# Altium schematic sheet Transceiver.SchDoc: FMC SDR Transceiver Board
size 420 x 297 mm; CheckedBy: -; CompanyName: CERN; DrawnBy: DrawnBy; Organization: CERN; Address1: European Organization for Nuclear Research; Address2: CH-1211 Genčve 23 - Switzerland; Revision: -; SheetNumber: -; SheetTotal: -; EDA_Number: EDA-XXXXX-VX-X; Projet: -; ModifiedBy: -; CreateDate: XX/XX/XXXX; CheckedDate: -; Title2: AD9364; DivGrp: TE/MPE; Designer: Designer; ModifiedDate: -
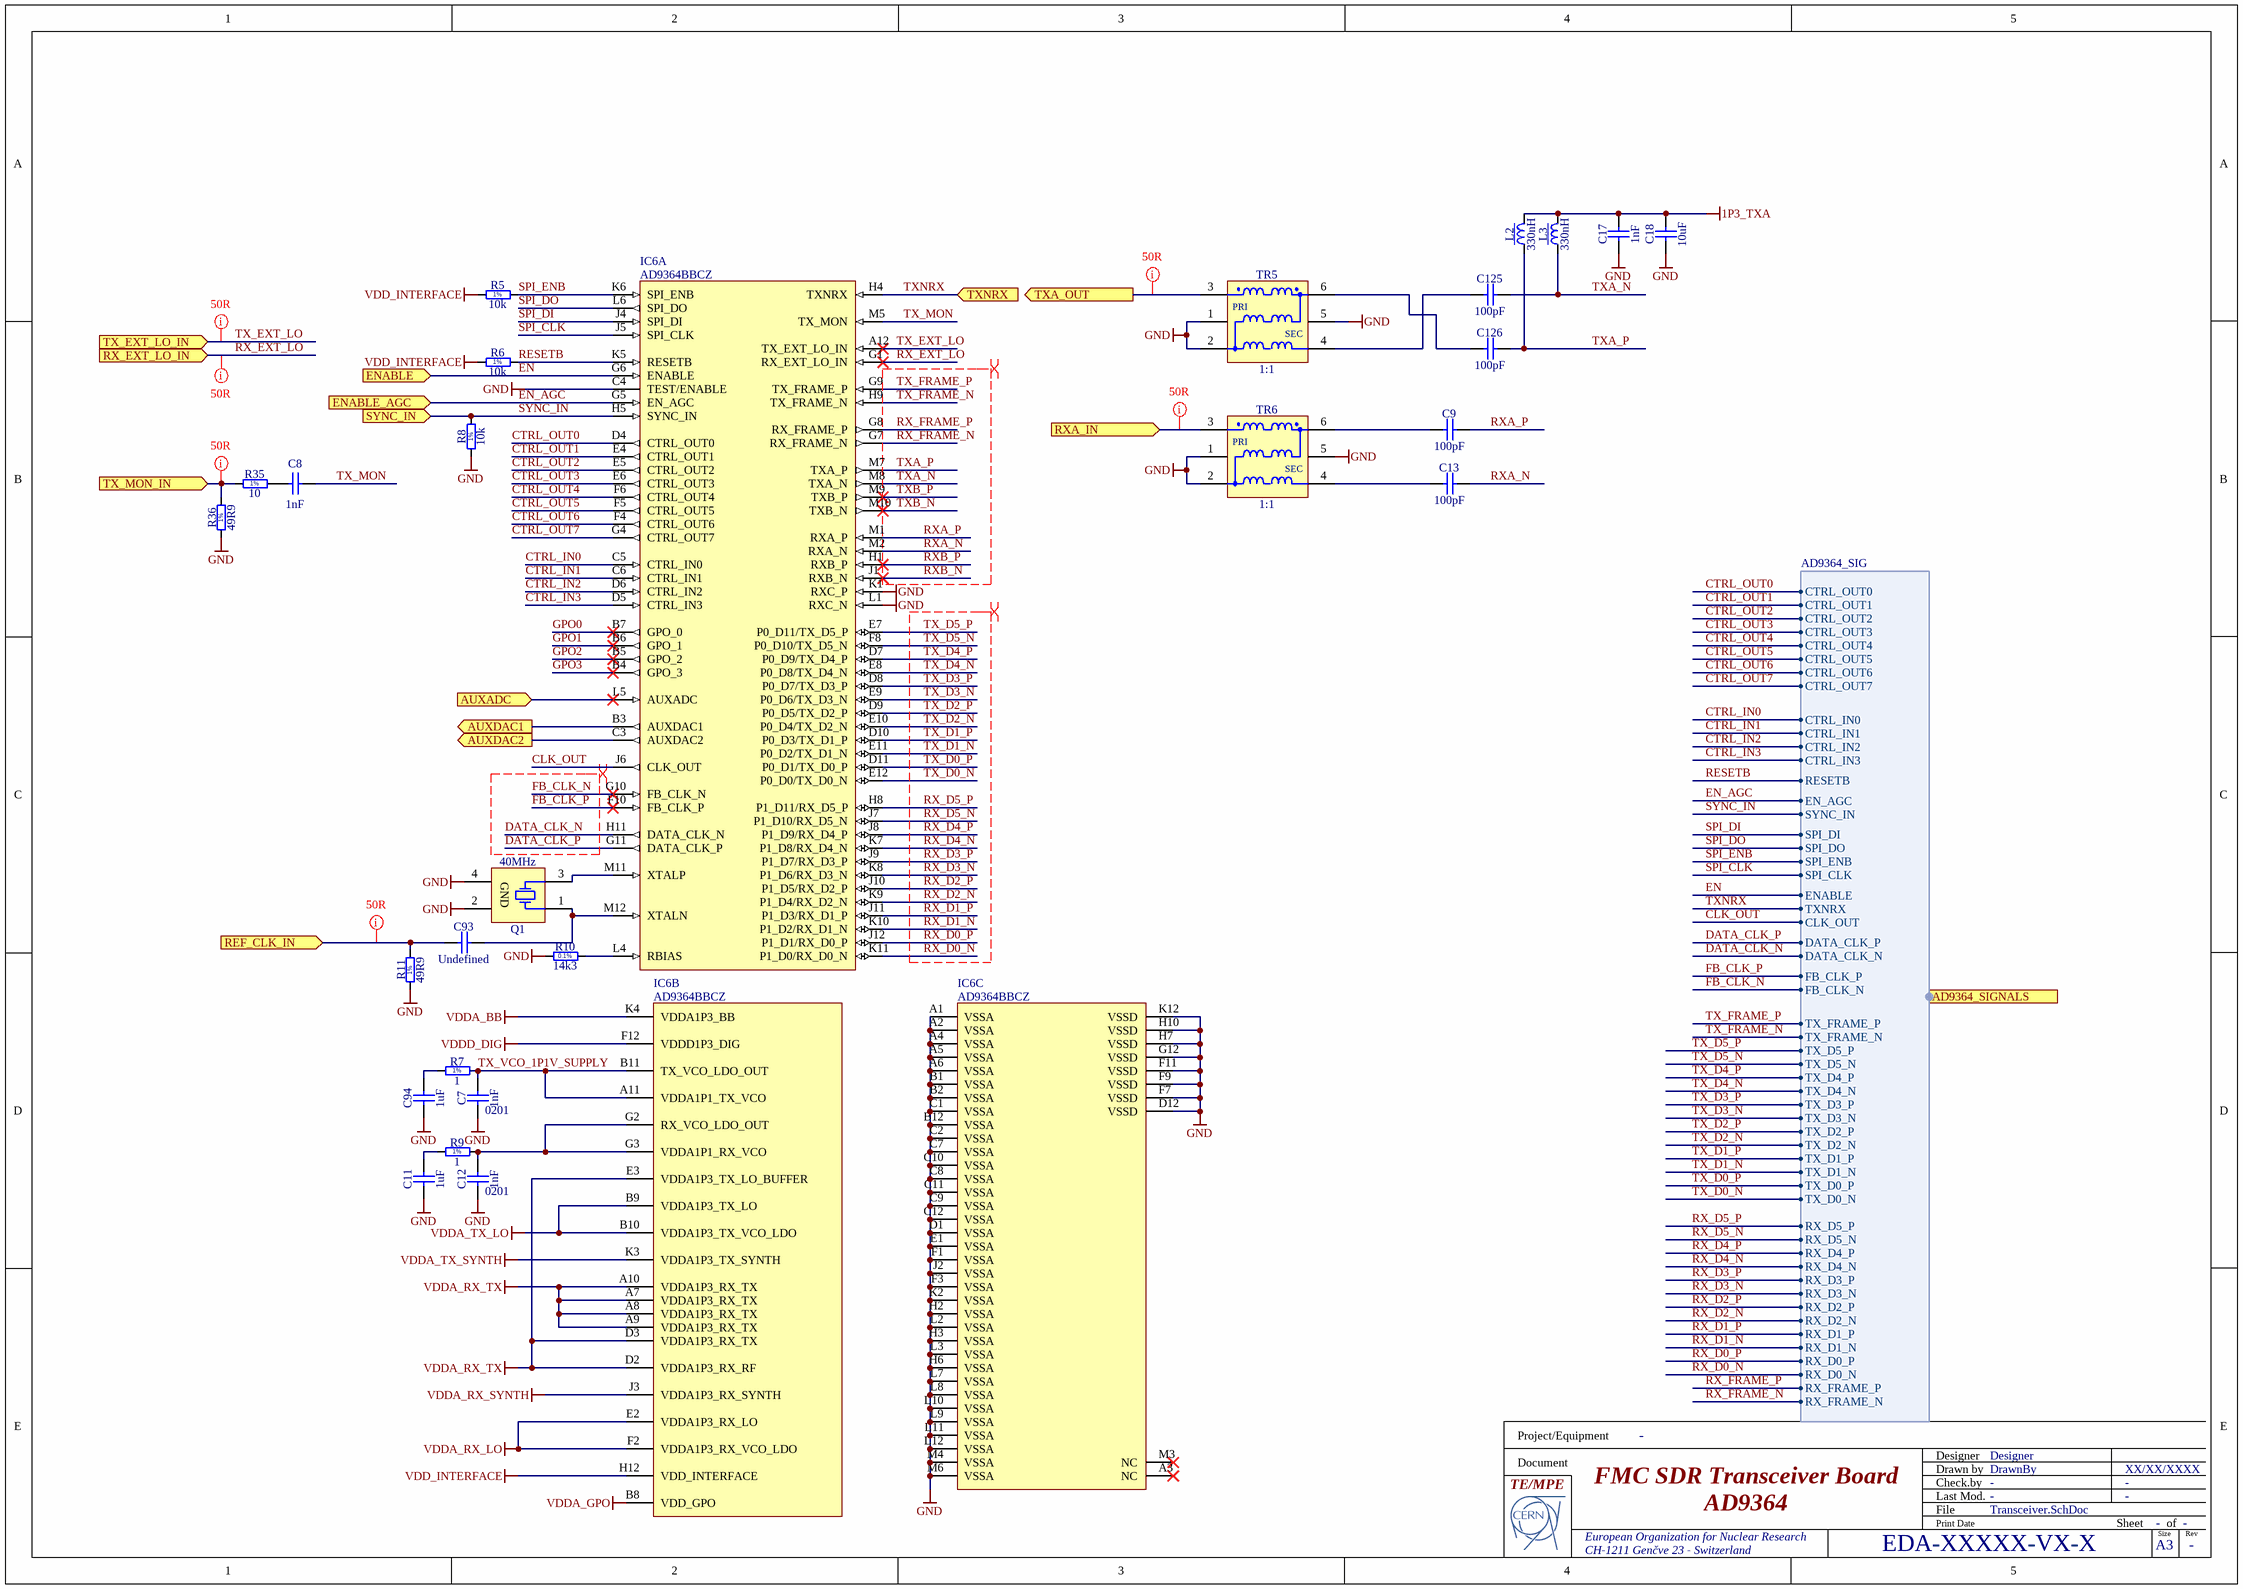
[diagram p0: Transceiver.SchDoc]

## Parts
C7  1nF  Case: 0201  [CAPC0603X33N]
C8  1nF  [CAPC1005X55N]
C9  100pF  [CAPC1005X55N]
C11  1uF  [CAPC1005X55N]
C12  1nF  Case: 0201  [CAPC0603X33N]
C13  100pF  [CAPC1005X55N]
C17  1nF  [CAPC1005X55N]
C18  10uF  [CAPC1608X80N]
C93  Undefined  [CAPC1608X90N]
C94  1uF  [CAPC1005X55N]
C125  100pF  [CAPC1005X55N]
C126  100pF  [CAPC1005X55N]
IC6  AD9364BBCZ  [BGA144C80P12X12_1000X1000X170]  (parts A,B,C of 3)
L2  330nH  [IND_COILCRAFT_0805CS]
L3  330nH  [IND_COILCRAFT_0805CS]
Q1  40MHz  [XTAL_EPSON_TSX-3225]
R5  10k  [RESC1005X40N]
R6  10k  [RESC1005X40N]
R7  1  [RESC1005X40N]
R8  10k  [RESC1005X40N]
R9  1  [RESC1005X40N]
R10  14k3  [RESC1608X55N]
R11  49R9  [RESC1005X40N]
R35  10  [RESC1005X40N]
R36  49R9  [RESC1005X40N]
TR5  1:1  [XFMR_MINI-CIRCUITS_DB1627]
TR6  1:1  [XFMR_MINI-CIRCUITS_DB1627]

## Ports
AD9364_SIGNALS (in, harness AD9364_SIG), AUXADC (in), AUXDAC1 (out), AUXDAC2 (out), ENABLE (in), ENABLE_AGC (in), REF_CLK_IN (in), RX_EXT_LO_IN (in), RXA_IN (in), SYNC_IN (in), TX_EXT_LO_IN (in), TX_MON_IN (in), TXA_OUT (out), TXNRX (in)

## Harnesses
AD9364_SIG: CTRL_OUT0, CTRL_OUT1, CTRL_OUT2, CTRL_OUT3, CTRL_OUT4, CTRL_OUT5, CTRL_OUT6, CTRL_OUT7, CTRL_IN0, CTRL_IN1, CTRL_IN2, CTRL_IN3, RESETB, EN_AGC, SYNC_IN, SPI_DI, SPI_DO, SPI_ENB, SPI_CLK, ENABLE, TXNRX, CLK_OUT, DATA_CLK_P, DATA_CLK_N, FB_CLK_P, FB_CLK_N, TX_FRAME_P, TX_FRAME_N, TX_D5_P, TX_D5_N, TX_D4_P, TX_D4_N, TX_D3_P, TX_D3_N, TX_D2_P, TX_D2_N, TX_D1_P, TX_D1_N, TX_D0_P, TX_D0_N, RX_D5_P, RX_D5_N, RX_D4_P, RX_D4_N, RX_D3_P, RX_D3_N, RX_D2_P, RX_D2_N, RX_D1_P, RX_D1_N, RX_D0_P, RX_D0_N, RX_FRAME_P, RX_FRAME_N

## Nets
1P3_TXA: C17.2 C18.2 L2.2 L3.2
GND: C7.1 C11.1 C12.1 C17.1 C18.1 C94.1 IC6.A1(VSSA) IC6.A2(VSSA) IC6.A4(VSSA) IC6.A5(VSSA) IC6.A6(VSSA) IC6.B1(VSSA) IC6.B2(VSSA) IC6.B12(VSSA) IC6.C1(VSSA) IC6.C2(VSSA) IC6.C4(TEST/ENABLE) IC6.C7(VSSA) IC6.C8(VSSA) IC6.C9(VSSA) IC6.C10(VSSA) IC6.C11(VSSA) IC6.C12(VSSA) IC6.D1(VSSA) IC6.D12(VSSD) IC6.E1(VSSA) IC6.F1(VSSA) IC6.F3(VSSA) IC6.F7(VSSD) IC6.F9(VSSD) IC6.F11(VSSD) IC6.G12(VSSD) IC6.H2(VSSA) IC6.H3(VSSA) IC6.H6(VSSA) IC6.H7(VSSD) IC6.H10(VSSD) IC6.J2(VSSA) IC6.K1(RXC_P) IC6.K2(VSSA) IC6.K12(VSSD) IC6.L1(RXC_N) IC6.L2(VSSA) IC6.L3(VSSA) IC6.L7(VSSA) IC6.L8(VSSA) IC6.L9(VSSA) IC6.L10(VSSA) IC6.L11(VSSA) IC6.L12(VSSA) IC6.M4(VSSA) IC6.M6(VSSA) Q1.2(GND) Q1.4(GND) R8.1 R10.1 R11.1 R36.1 TR5.1(NC) TR5.2(P1) TR5.5(NC) TR6.1(NC) TR6.2(P1) TR6.5(NC)
VDD_INTERFACE: IC6.H12(VDD_INTERFACE) R5.1 R6.1
VDDA_BB: IC6.K4(VDDA1P3_BB)
VDDA_GPO: IC6.B8(VDD_GPO)
VDDA_RX_LO: IC6.E2(VDDA1P3_RX_LO) IC6.F2(VDDA1P3_RX_VCO_LDO)
VDDA_RX_SYNTH: IC6.J3(VDDA1P3_RX_SYNTH)
VDDA_RX_TX: IC6.A7(VDDA1P3_RX_TX) IC6.A8(VDDA1P3_RX_TX) IC6.A9(VDDA1P3_RX_TX) IC6.A10(VDDA1P3_RX_TX) IC6.D2(VDDA1P3_RX_RF) IC6.D3(VDDA1P3_RX_TX) IC6.E3(VDDA1P3_TX_LO_BUFFER)
VDDA_TX_LO: IC6.B9(VDDA1P3_TX_LO) IC6.B10(VDDA1P3_TX_VCO_LDO)
VDDA_TX_SYNTH: IC6.K3(VDDA1P3_TX_SYNTH)
VDDD_DIG: IC6.F12(VDDD1P3_DIG)
AUXADC: IC6.L5(AUXADC) ; port AUXADC
AUXDAC1: IC6.B3(AUXDAC1) ; port AUXDAC1
AUXDAC2: IC6.C3(AUXDAC2) ; port AUXDAC2
CLK_OUT: IC6.J6(CLK_OUT) ; port AD9364_SIGNALS.CLK_OUT
CTRL_IN0: IC6.C5(CTRL_IN0) ; port AD9364_SIGNALS.CTRL_IN0
CTRL_IN1: IC6.C6(CTRL_IN1) ; port AD9364_SIGNALS.CTRL_IN1
CTRL_IN2: IC6.D6(CTRL_IN2) ; port AD9364_SIGNALS.CTRL_IN2
CTRL_IN3: IC6.D5(CTRL_IN3) ; port AD9364_SIGNALS.CTRL_IN3
CTRL_OUT0: IC6.D4(CTRL_OUT0) ; port AD9364_SIGNALS.CTRL_OUT0
CTRL_OUT1: IC6.E4(CTRL_OUT1) ; port AD9364_SIGNALS.CTRL_OUT1
CTRL_OUT2: IC6.E5(CTRL_OUT2) ; port AD9364_SIGNALS.CTRL_OUT2
CTRL_OUT3: IC6.E6(CTRL_OUT3) ; port AD9364_SIGNALS.CTRL_OUT3
CTRL_OUT4: IC6.F6(CTRL_OUT4) ; port AD9364_SIGNALS.CTRL_OUT4
CTRL_OUT5: IC6.F5(CTRL_OUT5) ; port AD9364_SIGNALS.CTRL_OUT5
CTRL_OUT6: IC6.F4(CTRL_OUT6) ; port AD9364_SIGNALS.CTRL_OUT6
CTRL_OUT7: IC6.G4(CTRL_OUT7) ; port AD9364_SIGNALS.CTRL_OUT7
DATA_CLK_N: IC6.H11(DATA_CLK_N) ; port AD9364_SIGNALS.DATA_CLK_N
DATA_CLK_P: IC6.G11(DATA_CLK_P) ; port AD9364_SIGNALS.DATA_CLK_P
EN: IC6.G6(ENABLE) ; port ENABLE, port AD9364_SIGNALS.ENABLE
EN_AGC: IC6.G5(EN_AGC) ; port ENABLE_AGC, port AD9364_SIGNALS.EN_AGC
FB_CLK_N: IC6.G10(FB_CLK_N) ; port AD9364_SIGNALS.FB_CLK_N
FB_CLK_P: IC6.F10(FB_CLK_P) ; port AD9364_SIGNALS.FB_CLK_P
GPO0: IC6.B7(GPO_0)
GPO1: IC6.B6(GPO_1)
GPO2: IC6.B5(GPO_2)
GPO3: IC6.B4(GPO_3)
REF_CLK_IN: C93.1 R11.2 ; port REF_CLK_IN
RESETB: IC6.K5(RESETB) R6.2 ; port AD9364_SIGNALS.RESETB
RX_D0_N: IC6.K11(P1_D0/RX_D0_N) ; port AD9364_SIGNALS.RX_D0_N
RX_D0_P: IC6.J12(P1_D1/RX_D0_P) ; port AD9364_SIGNALS.RX_D0_P
RX_D1_N: IC6.K10(P1_D2/RX_D1_N) ; port AD9364_SIGNALS.RX_D1_N
RX_D1_P: IC6.J11(P1_D3/RX_D1_P) ; port AD9364_SIGNALS.RX_D1_P
RX_D2_N: IC6.K9(P1_D4/RX_D2_N) ; port AD9364_SIGNALS.RX_D2_N
RX_D2_P: IC6.J10(P1_D5/RX_D2_P) ; port AD9364_SIGNALS.RX_D2_P
RX_D3_N: IC6.K8(P1_D6/RX_D3_N) ; port AD9364_SIGNALS.RX_D3_N
RX_D3_P: IC6.J9(P1_D7/RX_D3_P) ; port AD9364_SIGNALS.RX_D3_P
RX_D4_N: IC6.K7(P1_D8/RX_D4_N) ; port AD9364_SIGNALS.RX_D4_N
RX_D4_P: IC6.J8(P1_D9/RX_D4_P) ; port AD9364_SIGNALS.RX_D4_P
RX_D5_N: IC6.J7(P1_D10/RX_D5_N) ; port AD9364_SIGNALS.RX_D5_N
RX_D5_P: IC6.H8(P1_D11/RX_D5_P) ; port AD9364_SIGNALS.RX_D5_P
RX_EXT_LO: IC6.G1(RX_EXT_LO_IN) ; port RX_EXT_LO_IN
RX_FRAME_N: IC6.G7(RX_FRAME_N) ; port AD9364_SIGNALS.RX_FRAME_N
RX_FRAME_P: IC6.G8(RX_FRAME_P) ; port AD9364_SIGNALS.RX_FRAME_P
RXA_IN: TR6.3(P1) ; port RXA_IN
RXA_N: C13.2 IC6.M2(RXA_N)
RXA_P: C9.2 IC6.M1(RXA_P)
RXB_N: IC6.J1(RXB_N)
RXB_P: IC6.H1(RXB_P)
SPI_CLK: IC6.J5(SPI_CLK) ; port AD9364_SIGNALS.SPI_CLK
SPI_DI: IC6.J4(SPI_DI) ; port AD9364_SIGNALS.SPI_DI
SPI_DO: IC6.L6(SPI_DO) ; port AD9364_SIGNALS.SPI_DO
SPI_ENB: IC6.K6(SPI_ENB) R5.2 ; port AD9364_SIGNALS.SPI_ENB
SYNC_IN: IC6.H5(SYNC_IN) R8.2 ; port SYNC_IN, port AD9364_SIGNALS.SYNC_IN
TX_D0_N: IC6.E12(P0_D0/TX_D0_N) ; port AD9364_SIGNALS.TX_D0_N
TX_D0_P: IC6.D11(P0_D1/TX_D0_P) ; port AD9364_SIGNALS.TX_D0_P
TX_D1_N: IC6.E11(P0_D2/TX_D1_N) ; port AD9364_SIGNALS.TX_D1_N
TX_D1_P: IC6.D10(P0_D3/TX_D1_P) ; port AD9364_SIGNALS.TX_D1_P
TX_D2_N: IC6.E10(P0_D4/TX_D2_N) ; port AD9364_SIGNALS.TX_D2_N
TX_D2_P: IC6.D9(P0_D5/TX_D2_P) ; port AD9364_SIGNALS.TX_D2_P
TX_D3_N: IC6.E9(P0_D6/TX_D3_N) ; port AD9364_SIGNALS.TX_D3_N
TX_D3_P: IC6.D8(P0_D7/TX_D3_P) ; port AD9364_SIGNALS.TX_D3_P
TX_D4_N: IC6.E8(P0_D8/TX_D4_N) ; port AD9364_SIGNALS.TX_D4_N
TX_D4_P: IC6.D7(P0_D9/TX_D4_P) ; port AD9364_SIGNALS.TX_D4_P
TX_D5_N: IC6.F8(P0_D10/TX_D5_N) ; port AD9364_SIGNALS.TX_D5_N
TX_D5_P: IC6.E7(P0_D11/TX_D5_P) ; port AD9364_SIGNALS.TX_D5_P
TX_EXT_LO: IC6.A12(TX_EXT_LO_IN) ; port TX_EXT_LO_IN
TX_FRAME_N: IC6.H9(TX_FRAME_N) ; port AD9364_SIGNALS.TX_FRAME_N
TX_FRAME_P: IC6.G9(TX_FRAME_P) ; port AD9364_SIGNALS.TX_FRAME_P
TX_MON: C8.1 IC6.M5(TX_MON)
TX_MON_IN: R35.1 R36.2 ; port TX_MON_IN
TX_VCO_1P1V_SUPPLY: C7.2 IC6.A11(VDDA1P1_TX_VCO) IC6.B11(TX_VCO_LDO_OUT) R7.2
TXA_N: C125.2 IC6.M8(TXA_N) L3.1
TXA_OUT: TR5.3(P1) ; port TXA_OUT
TXA_P: C126.2 IC6.M7(TXA_P) L2.1
TXB_N: IC6.M10(TXB_N)
TXB_P: IC6.M9(TXB_P)
TXNRX: IC6.H4(TXNRX) ; port TXNRX, port AD9364_SIGNALS.TXNRX
NetC8_2: C8.2 R35.2
NetC9_1: C9.1 TR6.6(S1)
NetC11_2: C11.2 R9.1
NetC12_2: C12.2 IC6.G2(RX_VCO_LDO_OUT) IC6.G3(VDDA1P1_RX_VCO) R9.2
NetC13_1: C13.1 TR6.4(S1)
NetC93_2: C93.2 IC6.M12(XTALN) Q1.1(X)
NetC94_2: C94.2 R7.1
NetC125_1: C125.1 TR5.4(S1)
NetC126_1: C126.1 TR5.6(S1)
NetIC6_L4: IC6.L4(RBIAS) R10.2
NetIC6_M11: IC6.M11(XTALP) Q1.3(X)

Not connected (* = marked no-connect by the designer): IC6 A3(NC)* M3(NC)*

## Layout directives
differential pair: DATA_CLK_N, DATA_CLK_P, FB_CLK_N, FB_CLK_P, RX_D0_N, RX_D0_P, RX_D1_N, RX_D1_P, RX_D2_N, RX_D2_P, RX_D3_N, RX_D3_P, RX_D4_N, RX_D4_P, RX_D5_N, RX_D5_P, RX_FRAME_N, RX_FRAME_P, RXA_N, RXA_P, RXB_N, RXB_P, TX_D0_N, TX_D0_P, TX_D1_N, TX_D1_P, TX_D2_N, TX_D2_P, TX_D3_N, TX_D3_P, TX_D4_N, TX_D4_P, TX_D5_N, TX_D5_P, TX_FRAME_N, TX_FRAME_P, TXA_N, TXA_P, TXB_N, TXB_P
net class 50R_class: REF_CLK_IN, RX_EXT_LO, RXA_IN, TX_EXT_LO, TX_MON_IN, TXA_OUT

## Notes on the sheet
- Project/Equipment
- Document
- Designer
- Drawn by
- Check.by
- File
- Last Mod.
- Print Date
- Sheet
- Size
- A3
- of
- Rev
- (in symbol R0402_1R_1%_0.0625W_200PPM) 1%
- (in symbol R0402_10K_1%_0.0625W_100PPM) 1%
- (in symbol R0402_10R_1%_0.0625W_200PPM) 1%
- (in symbol R0402_49R9_1%_0.0625W_100PPM) 1%
- (in symbol R0603_14K3_0.1%_0.063W_10PPM) 0.1%
- (in symbol XFMR_MINI-CIRCUITS_TCM1-63AX+) PRI; SEC

## Library data of the parts
C7 C12 = CC0201_1NF_16V_10%_X5R: Non-polarised capacitor; Part Description: SMD Multilayer Chip Ceramic Capacitor; Manufacturer: GENERIC; Manufacturer1 Part Number: 0201YD102KAT2A; Voltage: 16V; TC: X5R; Tolerance: ±10%; Part Number: CC0201_1NF_16V_10%_X5R; Component Kind: Standard; Component Type: Standard; Pin Count: 2; Value: 1nF; Status: Not Recommended; Manufacturer Part Number: CC0201_1NF_16V_10%_X5R; Mounted: Yes; Socket: No; SMD: Yes; Sense: No; Manufacturer1 Example: AVX; Manufacturer1 ComponentHeight: 0.33mm; HelpURL: \\cern.ch\dfs\Applications\Altium\Datasheets\CC0201_X5R_AVX.pdf; Author: CERN DEM JLC; CreateDate: 03.12.2007; LatestRevisionDate: 03.12.2007
C8 C17 = CC0402_1NF_50V_10%_X7R: Non-polarised capacitor; Part Description: SMD Multilayer Chip Ceramic Capacitor; Manufacturer: GENERIC; Manufacturer1 Part Number: 223858715623; Voltage: 50V; TC: X7R; Tolerance: ±10%; Part Number: CC0402_1NF_50V_10%_X7R; Component Kind: Standard; Component Type: Standard; Pin Count: 2; Value: 1nF; Status: Not Recommended; Manufacturer Part Number: CC0402_1NF_50V_10%_X7R; Case: 0402; Mounted: Yes; Socket: No; SMD: Yes; Sense: No; Manufacturer1 Example: PHYCOMP; Manufacturer1 ComponentHeight: 0.55mm; HelpURL: \\cern.ch\dfs\Applications\Altium\Datasheets\CC0402_X7R_PHYCOMP.pdf; Author: CERN DEM JLC; CreateDate: 03.12.2007; LatestRevisionDate: 03.12.2007
C9 C13 C125 C126 = CC0402_100PF_50V_5%_C0G: Non-polarised capacitor; Part Description: SMD Multilayer Chip Ceramic Capacitor; Manufacturer: GENERIC; Manufacturer1 Part Number: C0402C101J5GACTU; Voltage: 50V; TC: C0G/NP0; Tolerance: ±5%; Part Number: CC0402_100PF_50V_5%_C0G; Component Kind: Standard; Component Type: Standard; Pin Count: 2; Value: 100pF; Status: Preferred; Manufacturer Part Number: CC0402_100PF_50V_5%_C0G; Case: 0402; Mounted: Yes; Socket: No; SMD: Yes; Sense: No; Manufacturer1 Example: KEMET; Manufacturer1 ComponentHeight: 0.55mm; HelpURL: \\cern.ch\dfs\Applications\Altium\Datasheets\CC0805_C0G_KEMET_(Commercial Grade).pdf; Author: CERN DEM JLC; CreateDate: 03.12.2007; LatestRevisionDate: 22.04.2015
C11 C94 = CC0402_1UF_16V_10%_X5R: Non-polarised capacitor; Part Description: SMD Multilayer Chip Ceramic Capacitor; Manufacturer: GENERIC; Manufacturer1 Part Number: C1005X5R1C105KT; Voltage: 16V; TC: X5R; Tolerance: ±10%; Part Number: CC0402_1UF_16V_10%_X5R; Component Kind: Standard; Component Type: Standard; Pin Count: 2; Value: 1uF; Status: Preferred; Manufacturer Part Number: CC0402_1UF_16V_10%_X5R; Case: 0402; Mounted: Yes; Socket: No; SMD: Yes; Sense: No; Manufacturer1 Example: TDK; Manufacturer1 ComponentHeight: 0.55mm; HelpURL: \\cern.ch\dfs\Applications\Altium\Datasheets\CC0402_X5R_TDK_C.pdf; Author: CERN DEM JLC; CreateDate: 25.10.2012; LatestRevisionDate: 25.10.2012
C18 = CC0603_10UF_10V_10%_X5R: Non-polarised capacitor; Part Description: SMD Multilayer Chip Ceramic Capacitor; Manufacturer: GENERIC; Manufacturer1 Part Number: GRM188R61A106KE69D; Voltage: 10V; TC: X5R; Tolerance: ±10%; Part Number: CC0603_10UF_10V_10%_X5R; Component Kind: Standard; Component Type: Standard; Pin Count: 2; Value: 10uF; Status: None; Manufacturer Part Number: CC0603_10UF_10V_10%_X5R; Case: 0603; Mounted: Yes; Socket: No; SMD: Yes; Sense: No; Manufacturer1 Example: MURATA; Manufacturer1 ComponentHeight: 0.8mm; HelpURL: \\cern.ch\dfs\Applications\Altium\Datasheets\CC0603_MURATA_GRM188R61A106KE69D.pdf; Author: CERN DEM JLC; CreateDate: 31.01.2017; LatestRevisionDate: 31.01.2017
C93 = CC0603_NO-VALUE: Non-polarised capacitor; Part Description: Reserved Footprint For 0603(1608) Chip Ceramic Capacitor; Mounted: No; Part Number: CC0603_NO-VALUE; Component Kind: Standard; Component Type: Standard; Pin Count: 2; Value: Undefined; Status: None; Manufacturer: Undefined; Manufacturer Part Number: CC0603_NO-VALUE; Case: 0603; Socket: No; SMD: Yes; Sense: No; Manufacturer1 ComponentHeight: 0.9mm; HelpURL: Undefined; Author: CERN DEM MR; CreateDate: 22.11.2016; LatestRevisionDate: 22.11.2016
IC6 = AD9364BBCZ: RF 1×1 transceiver with integrated 12-bit DACs and ADCs; Manufacturer: ANALOG DEVICES; PressFit: No; Bonding: No; Part Number: AD9364BBCZ; Component Kind: Standard; Component Type: Standard; Device: AD9364BBCZ; PackageDescription: BGA, 0.80mm Pitch, Square; 144 Pin,12 Columns X 12 Rows,10.00mm X 10.00mm X 1.70mm H; Part Description: RF 1 × 1 Transceiver with Integrated 12-bit DACs and ADCs; Manufacturer Part Number: AD9364BBCZ; Pin Count: 144; Case: BGA144; Mounted: Yes; Socket: No; SMD: Yes; Sense: No; ComponentHeight: 1.7mm; Author: CERN DEM JLC; HelpURL: \\cern.ch\dfs\Applications\Altium\Datasheets\AD9364BBCZ.pdf; CreateDate: 06.12.2018; LatestRevisionDate: 06.12.2018
L2 L3 = IND_330NH_2%_COILCRAFT_0805CS: Inductor With Core; Part Description: SMT Chip Inductor; Manufacturer Part Number: 0805CS-331XGL; Power: 310mA; Resistance: 1.4R; Tolerance: ±2%; Part Number: IND_330NH_2%_COILCRAFT_0805CS; Component Kind: Standard; Component Type: Standard; Pin Count: 2; Value: 330nH; Status: None; Manufacturer: COILCRAFT; Case: 0805; Mounted: Yes; Socket: No; SMD: Yes; Sense: No; ComponentHeight: 1.52mm; HelpURL: \\cern.ch\dfs\Applications\Altium\Datasheets\IND_COILCRAFT_0805CS.pdf; Author: CERN DEM JMW; CreateDate: 26.10.2015; LatestRevisionDate: 26.10.2015
Q1 = X_CRYSTAL_SMD_3.2x2.5_40MHz: 40MHz ±10ppm Crystal 7pF 40 Ohms 4-SMD, No Lead; Part Number: XTAL_24MHZ_EPSON_ X1E000021036701; Part Description: Tolerance ±10 ppm,  Stability:± 10ppm, -40°C to 85°C, 9pF, Surface Mount Quartz Crystal, TX-3225 Series; Manufacturer: EPSON; Manufacturer Part Number: X1E000021036701; PressFit: No; Component Kind: Standard; Component Type: Standard; PackageDescription: Crystal TSX-3225 Serie, Corner Concave; 4 pin, 2.50mm L X 3.2mm W X 0.6mm H; Value: 40MHz; Pin Count: 4; Mounted: Yes; Socket: No; SMD: Yes; Sense: No; Bonding: No; ComponentHeight: 0.6mm; HelpURL: \\cern.ch\dfs\Applications\Altium\Datasheets\XTAL_EPSON_TSX-3225.pdf; ComponentLink1URL: \\cern.ch\dfs\Applications\Altium\Datasheets\XTAL_EPSON_TSX-3225_Ordering-Informations.pdf; ComponentLink1Description: Ordering Informations; Author: GK; CreateDate: 06.10.2016; LatestRevisionDate: 06.10.2016
R5 R6 R8 = R0402_10K_1%_0.0625W_100PPM: Resistor - 1%; Part Description: General Purpose Thick Film Chip Resistor; Manufacturer: GENERIC; Manufacturer1 Part Number: 232270671003L; TC: ±100ppm/°C; PressFit: No; Part Number: R0402_10K_1%_0.0625W_100PPM; Component Kind: Standard; Component Type: Standard; Pin Count: 2; Value: 10k; Status: Not Recommended; Power: 0.0625W; Tolerance: ±1%; Manufacturer Part Number: R0402_10K_1%_0.0625W_100PPM; Case: 0402; Mounted: Yes; Sense: No; Socket: No; SMD: Yes; Manufacturer1 Example: YAGEO PHYCOMP; Manufacturer1 ComponentHeight: 0.4mm; HelpURL: \\cern.ch\dfs\Applications\Altium\Datasheets\R0402_Phycomp_RC0402.pdf; Author: CERN DEM JLC; CreateDate: 03.12.2007; LatestRevisionDate: 17.10.2012
R7 R9 = R0402_1R_1%_0.0625W_200PPM: Resistor - 1%; Part Description: General Purpose Thick Film Chip Resistor; Manufacturer: GENERIC; Manufacturer1 Part Number: 232270671008L; TC: ±200ppm/°C; PressFit: No; Part Number: R0402_1R_1%_0.0625W_200PPM; Component Kind: Standard; Component Type: Standard; Pin Count: 2; Value: 1; Status: Not Recommended; Power: 0.0625W; Tolerance: ±1%; Manufacturer Part Number: R0402_1R_1%_0.0625W_200PPM; Case: 0402; Mounted: Yes; Sense: No; Socket: No; SMD: Yes; Manufacturer1 Example: YAGEO PHYCOMP; Manufacturer1 ComponentHeight: 0.4mm; HelpURL: \\cern.ch\dfs\Applications\Altium\Datasheets\R0402_Phycomp_RC0402.pdf; Author: CERN DEM JLC; CreateDate: 03.12.2007; LatestRevisionDate: 17.10.2012
R10 = R0603_14K3_0.1%_0.063W_10PPM: Resistor - 0.1%; Part Description: Thin Film Chip Resistor; Manufacturer: GENERIC; Manufacturer1 Part Number: RN73C1J14K3BTDF; Power: 0.063W; TC: ±10ppm; PressFit: No; Part Number: R0603_14K3_0.1%_0.063W_10PPM; Component Kind: Standard; Component Type: Standard; Pin Count: 2; Value: 14k3; Status: Not Recommended; Tolerance: ±0.1%; Manufacturer Part Number: R0603_14K3_0.1%_0.063W_10PPM; Case: 0603; Mounted: Yes; Sense: No; Socket: No; SMD: Yes; Manufacturer1 Example: TYCO HOLSWORTHY; Manufacturer1 ComponentHeight: 0.5mm; HelpURL: \\cern.ch\dfs\Applications\Altium\Datasheets\R0603_Tyco_RN73.pdf; Author: CERN DEM JLC; CreateDate: 03.12.2007; LatestRevisionDate: 13.03.2008
R11 R36 = R0402_49R9_1%_0.0625W_100PPM: Resistor - 1%; Part Description: General Purpose Thick Film Chip Resistor; Manufacturer: GENERIC; Manufacturer1 Part Number: 232270674999L or RC0402FR-0749R9L; TC: ±100ppm/°C; PressFit: No; Part Number: R0402_49R9_1%_0.0625W_100PPM; Component Kind: Standard; Component Type: Standard; Pin Count: 2; Value: 49R9; Status: Not Recommended; Power: 0.0625W; Tolerance: ±1%; Manufacturer Part Number: R0402_49R9_1%_0.0625W_100PPM; Case: 0402; Mounted: Yes; Sense: No; Socket: No; SMD: Yes; Manufacturer1 Example: YAGEO PHYCOMP; Manufacturer1 ComponentHeight: 0.4mm; HelpURL: \\cern.ch\dfs\Applications\Altium\Datasheets\R0402_Phycomp_RC0402.pdf; Author: CERN DEM JLC; CreateDate: 24.10.2012; LatestRevisionDate: 24.10.2012
R35 = R0402_10R_1%_0.0625W_200PPM: Resistor - 1%; Part Description: General Purpose Thick Film Chip Resistor; Manufacturer: GENERIC; Manufacturer1 Part Number: 232270671009L; TC: ±200ppm/°C; PressFit: No; Part Number: R0402_10R_1%_0.0625W_200PPM; Component Kind: Standard; Component Type: Standard; Pin Count: 2; Value: 10; Status: Not Recommended; Power: 0.0625W; Tolerance: ±1%; Manufacturer Part Number: R0402_10R_1%_0.0625W_200PPM; Case: 0402; Mounted: Yes; Sense: No; Socket: No; SMD: Yes; Manufacturer1 Example: YAGEO PHYCOMP; Manufacturer1 ComponentHeight: 0.4mm; HelpURL: \\cern.ch\dfs\Applications\Altium\Datasheets\R0402_Phycomp_RC0402.pdf; Author: CERN DEM JLC; CreateDate: 24.06.2009; LatestRevisionDate: 17.10.2012
TR5 TR6 = XFMR_MINI-CIRCUITS_TCM1-63AX+: 50 Ohms 10  to 6000MHz RF Transformer; Power: 0.2W; Part Number: XFMR_MINI-CIRCUITS_TCM1-63AX+; Component Kind: Standard; Component Type: Standard; Pin Count: 6; Value: 1:1; Status: None; Part Description: 50 Ohms 10  to 6000MHz RF Transformer; Manufacturer: MINI-CIRCUITS; Manufacturer Part Number: TCM1-63AX+; Mounted: Yes; Socket: No; Sense: No; SMD: Yes; ComponentHeight: 4.06mm; HelpURL: \\cern.ch\dfs\Applications\Altium\Datasheets\XFMR_MINI-CIRCUITS_TCM1-63AX+.pdf; Author: CERN DEM MR; CreateDate: 08.02.2019; LatestRevisionDate: 08.02.2019